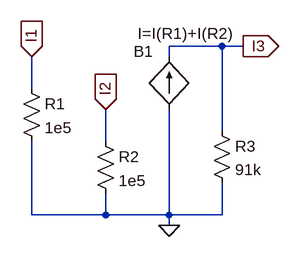
[diagram p0: schematic I1I2I3Mirror.asc]
I1I2I3Mirror.asc, the LTspice schematic file:
Version 4
SHEET 1 880 680
WIRE -112 224 -112 176
WIRE -112 416 -112 304
WIRE 0 304 0 256
WIRE 0 416 -112 416
WIRE 0 416 0 384
WIRE 96 176 96 160
WIRE 96 416 0 416
WIRE 96 416 96 256
WIRE 96 432 96 416
WIRE 176 160 96 160
WIRE 176 288 176 160
WIRE 176 416 96 416
WIRE 176 416 176 368
WIRE 208 160 176 160
FLAG -112 176 I1
IOPIN -112 176 In
FLAG 0 256 I2
IOPIN 0 256 In
FLAG 96 432 0
FLAG 208 160 I3
IOPIN 208 160 Out
SYMBOL bi 96 256 R180
WINDOW 0 24 88 Left 0
WINDOW 3 -96 115 Left 0
SYMATTR InstName B1
SYMATTR Value I=I(R1)+I(R2)
SYMBOL res -128 208 R0
SYMATTR InstName R1
SYMATTR Value 1e5
SYMBOL res -16 288 R0
SYMATTR InstName R2
SYMATTR Value 1e5
SYMBOL res 160 272 R0
SYMATTR InstName R3
SYMATTR Value 91k

The netlist it stands for:
* I1I2I3Mirror.asc
B1 0 I3 I=I(R1)+I(R2)
R1 I1 0 1e5
R2 I2 0 1e5
R3 I3 0 91k
.backanno
.end